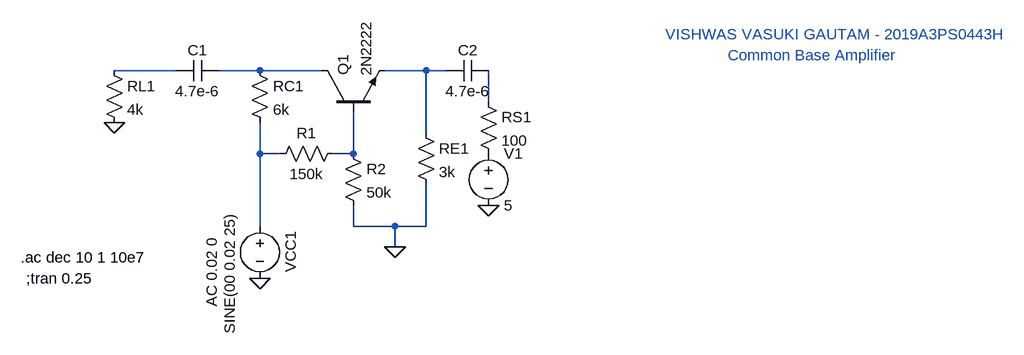
[diagram p0: schematic CB_amplifier.asc]
CB_amplifier.asc, the LTspice schematic file:
Version 4
SHEET 1 1444 680
WIRE 96 -64 0 -64
WIRE 224 -64 160 -64
WIRE 320 -64 224 -64
WIRE 480 -64 416 -64
WIRE 512 -64 480 -64
WIRE 576 -16 576 -64
WIRE 480 32 480 -64
WIRE 224 64 224 16
WIRE 256 64 224 64
WIRE 368 64 368 0
WIRE 368 64 336 64
WIRE 224 176 224 64
WIRE 368 176 368 144
WIRE 432 176 368 176
WIRE 480 176 480 112
WIRE 480 176 432 176
WIRE 432 208 432 176
FLAG 0 16 0
FLAG 576 144 0
FLAG 224 256 0
FLAG 432 208 0
SYMBOL npn 320 0 R270
SYMATTR InstName Q1
SYMATTR Value 2N2222
SYMBOL res 352 48 R90
WINDOW 0 0 56 VBottom 2
WINDOW 3 32 56 VTop 2
SYMATTR InstName R1
SYMATTR Value 150k
SYMBOL res 352 48 R0
SYMATTR InstName R2
SYMATTR Value 50k
SYMBOL res 208 -80 R0
SYMATTR InstName RC1
SYMATTR Value 6k
SYMBOL cap 160 -80 R90
WINDOW 0 0 32 VBottom 2
WINDOW 3 32 32 VTop 2
SYMATTR InstName C1
SYMATTR Value 4.7e-6
SYMBOL res -16 -80 R0
SYMATTR InstName RL1
SYMATTR Value 4k
SYMBOL cap 576 -80 R90
WINDOW 0 0 32 VBottom 2
WINDOW 3 32 32 VTop 2
SYMATTR InstName C2
SYMATTR Value 4.7e-6
SYMBOL voltage 224 160 R0
WINDOW 0 32 56 VTop 2
WINDOW 3 -62 89 VTop 2
WINDOW 123 -90 87 VTop 2
WINDOW 39 0 0 Left 2
SYMATTR InstName VCC1
SYMATTR Value SINE(00 0.02 25)
SYMATTR Value2 AC 0.02 0
SYMBOL res 560 -32 R0
SYMATTR InstName RS1
SYMATTR Value 100
SYMBOL res 464 16 R0
SYMATTR InstName RE1
SYMATTR Value 3k
SYMBOL voltage 576 48 R0
WINDOW 123 0 0 Left 2
WINDOW 39 0 0 Left 2
SYMATTR InstName V1
SYMATTR Value 5
TEXT -144 224 Left 2 !.ac dec 10 1 10e7
TEXT -136 256 Left 2 !;tran 0.25
TEXT 848 -120 Left 2 ;VISHWAS VASUKI GAUTAM - 2019A3PS0443H
TEXT 944 -88 Left 2 ;Common Base Amplifier

The netlist it stands for:
* CB_amplifier.asc
Q1 N002 N006 N003 0 2N2222
R1 N006 N005 150k
R2 N006 0 50k
RC1 N002 N005 6k
C1 N002 N001 4.7e-6
RL1 N001 0 4k
C2 N004 N003 4.7e-6
VCC1 N005 0 SINE(00 0.02 25) AC 0.02 0
RS1 N004 P001 100
RE1 N003 0 3k
V1 P001 0 5
.model NPN NPN
.model PNP PNP
.lib standard.bjt
.ac dec 10 1 10e7
;tran 0.25
* VISHWAS VASUKI GAUTAM - 2019A3PS0443H
* Common Base Amplifier
.backanno
.end